# Altium schematic sheet Connectors.SchDoc
size 203 x 127 mm
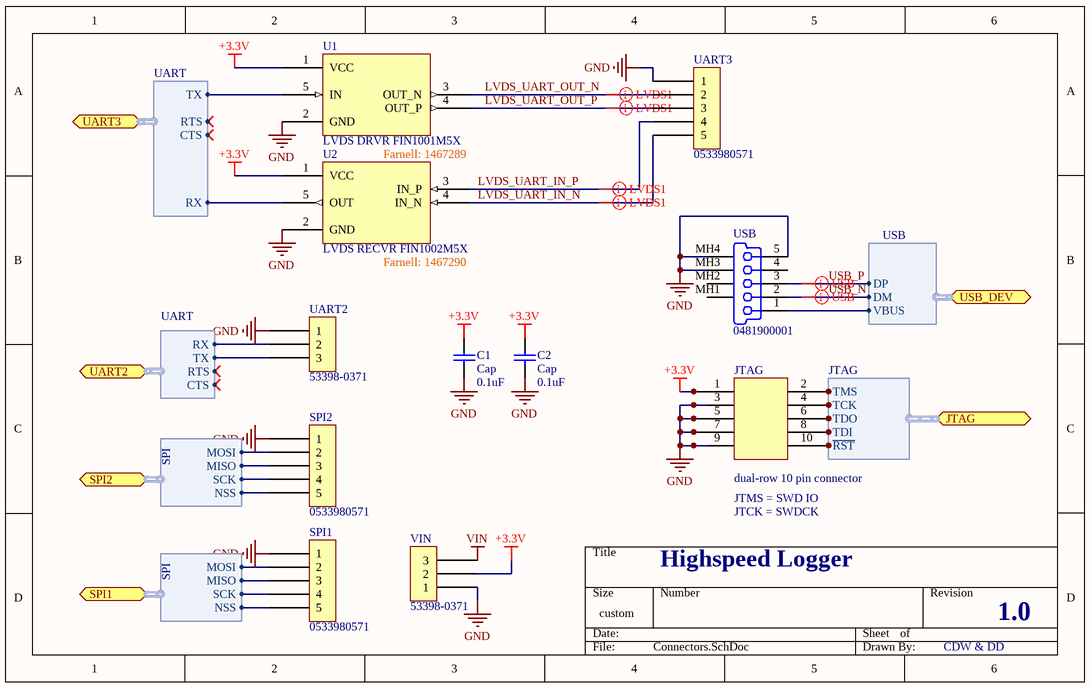
[diagram p0: Connectors.SchDoc]

## Parts
C1  Cap  value 0.1uF  [V0402]
C2  Cap  value 0.1uF  [V0402]
JTAG  dual-row 10 pin connector  [FTSH-105-01-L-DV-K-TR]
SPI1  0533980571  [5 pins picoblade 1,25 mm pitch, right-angle SMT - duplicate]
SPI2  0533980571  [5 pins picoblade 1,25 mm pitch, right-angle SMT - duplicate]
U1  LVDS DRVR FIN1001M5X  Farnell: 1467289  [SOT-23-5]
U2  LVDS RECVR FIN1002M5X  Farnell: 1467290  [SOT-23-5]
UART2  53398-0371  [3 pins picoblade 1,25 mm pitch, right-angle SMT]
UART3  0533980571  [5 pins picoblade 1,25 mm pitch, right-angle SMT - duplicate]
USB  0481900001  [USB/SM0.8-6H5]
VIN  53398-0371  [3 pins picoblade 1,25 mm pitch, right-angle SMT]

## Ports
JTAG (harness JTAG), SPI1 (harness SPI), SPI2 (harness SPI), UART2 (harness UART), UART3 (harness UART), USB_DEV (harness USB)

## Harnesses
SPI: MISO, MOSI, NSS, SCK
UART: CTS, RTS, RX, TX
USB: DM, DP, VBUS
JTAG: ~{RST}, TCK, TDI, TDO, TMS

## Nets
+3.3V: C1.2 C2.2 JTAG.1 U1.1(VCC) U2.1(VCC) VIN.2
GND: C1.1 C2.1 JTAG.3 JTAG.5 JTAG.7 JTAG.9 SPI1.1 SPI2.1 U1.2(GND) U2.2(GND) UART2.1 UART3.1 USB.5(GND) USB.MH3(Tab) USB.MH4(Tab) VIN.1
VIN: VIN.3
LVDS_UART_IN_N: U2.4(IN_N) UART3.5
LVDS_UART_IN_P: U2.3(IN_P) UART3.4
LVDS_UART_OUT_N: U1.3(OUT_N) UART3.2
LVDS_UART_OUT_P: U1.4(OUT_P) UART3.3
USB_N: USB.2(D-) ; port USB_DEV.DM
USB_P: USB.3(D+) ; port USB_DEV.DP
NetJTAG_2: JTAG.2 ; port JTAG.TMS
NetJTAG_4: JTAG.4 ; port JTAG.TCK
NetJTAG_6: JTAG.6 ; port JTAG.TDO
NetJTAG_8: JTAG.8 ; port JTAG.TDI
NetJTAG_10: JTAG.10 ; port JTAG.~{RST}
NetSPI1_2: SPI1.2 ; port SPI1.MOSI
NetSPI1_3: SPI1.3 ; port SPI1.MISO
NetSPI1_4: SPI1.4 ; port SPI1.SCK
NetSPI1_5: SPI1.5 ; port SPI1.NSS
NetSPI2_2: SPI2.2 ; port SPI2.MOSI
NetSPI2_3: SPI2.3 ; port SPI2.MISO
NetSPI2_4: SPI2.4 ; port SPI2.SCK
NetSPI2_5: SPI2.5 ; port SPI2.NSS
NetU1_5: U1.5(IN) ; port UART3.TX
NetU2_5: U2.5(OUT) ; port UART3.RX
NetUART2_2: UART2.2 ; port UART2.RX
NetUART2_3: UART2.3 ; port UART2.TX
NetUSB_1: USB.1(V_BUS_(5V)) ; port USB_DEV.VBUS

Not connected (* = marked no-connect by the designer): USB 4(NC) MH1(Tab) MH2(Tab)

## Layout directives
differential pair: LVDS_UART_IN_N, LVDS_UART_IN_P, LVDS_UART_OUT_N, LVDS_UART_OUT_P, USB_N, USB_P

## Notes on the sheet
- (near JTAG) JTMS = SWD IO
- Highspeed Logger
- JTCK = SWDCK
- 1.0
- CDW & DD

## Library data of the parts
C1 C2 = Cap: Capacitor; Published: 8-Jun-2000; LatestRevisionDate: 17-Jul-2002; LatestRevisionNote: Re-released for DXP Platform.; PackageReference: RAD-0.3; Publisher: Altium Limited; PackageDescription: Radial Cap, Thru-Hole; 2 Leads; 0.3 in Pin Spacing
SPI1 SPI2 UART3 = 0533980571: Molex picoblade 5 pins; Helios ID: 0; SETable: K; Placed on PCB: Y; Pitch: 1.25; No. of Contacts: 5; Gender: Header; Current Rating: 1A; Case: SMD; Manufacturer: Molex; Man. Part no: 0533980571; Material: LEADFREE
UART2 VIN = 53398-0371: PICOBLADE, 1,25 mm pitch, header, SMD; Manufacturer: Molex; Man. Part no: 0533980371; Helios ID: 0; SETable: K; Placed on PCB: Y; Pitch: 1.25; No. of Contacts: 3; Current Rating: 1A; Case: SMD; Material: LEADFREE; Gender: Header
USB = 0481900001: USB On-The-Go (OTG) Mini-B Receptacle, Right Angle, SMT, 0.80mm (.031") Pitch, Solder Tabs with Back Cover, Recessed Type; PCB_Layout: Complies with Manufacturer's Recommendation.; Published: 21-Sep-2007; DatasheetVersion: revA, May-2004; PackageVersion: May-2004; PackageReference: 481900001; Publisher: Altium Limited; PackageDescription: USB Mini-B, Sinking Type, SM; 5 Position; Right Angle, Body 11.45 x 11.8 x 3.9 mm (LxWxH); ComponentLink1Description: Manufacturer Link; ComponentLink1URL: http://www.molex.com/; ComponentLink2Description: Datasheet; ComponentLink2URL: http://www.molex.com/cmc_upload/0/000/895/958/SD-48190-001RevA.pdf